# Altium schematic sheet SMA_RF_CLK.SchDoc
size 330 x 1066 mm
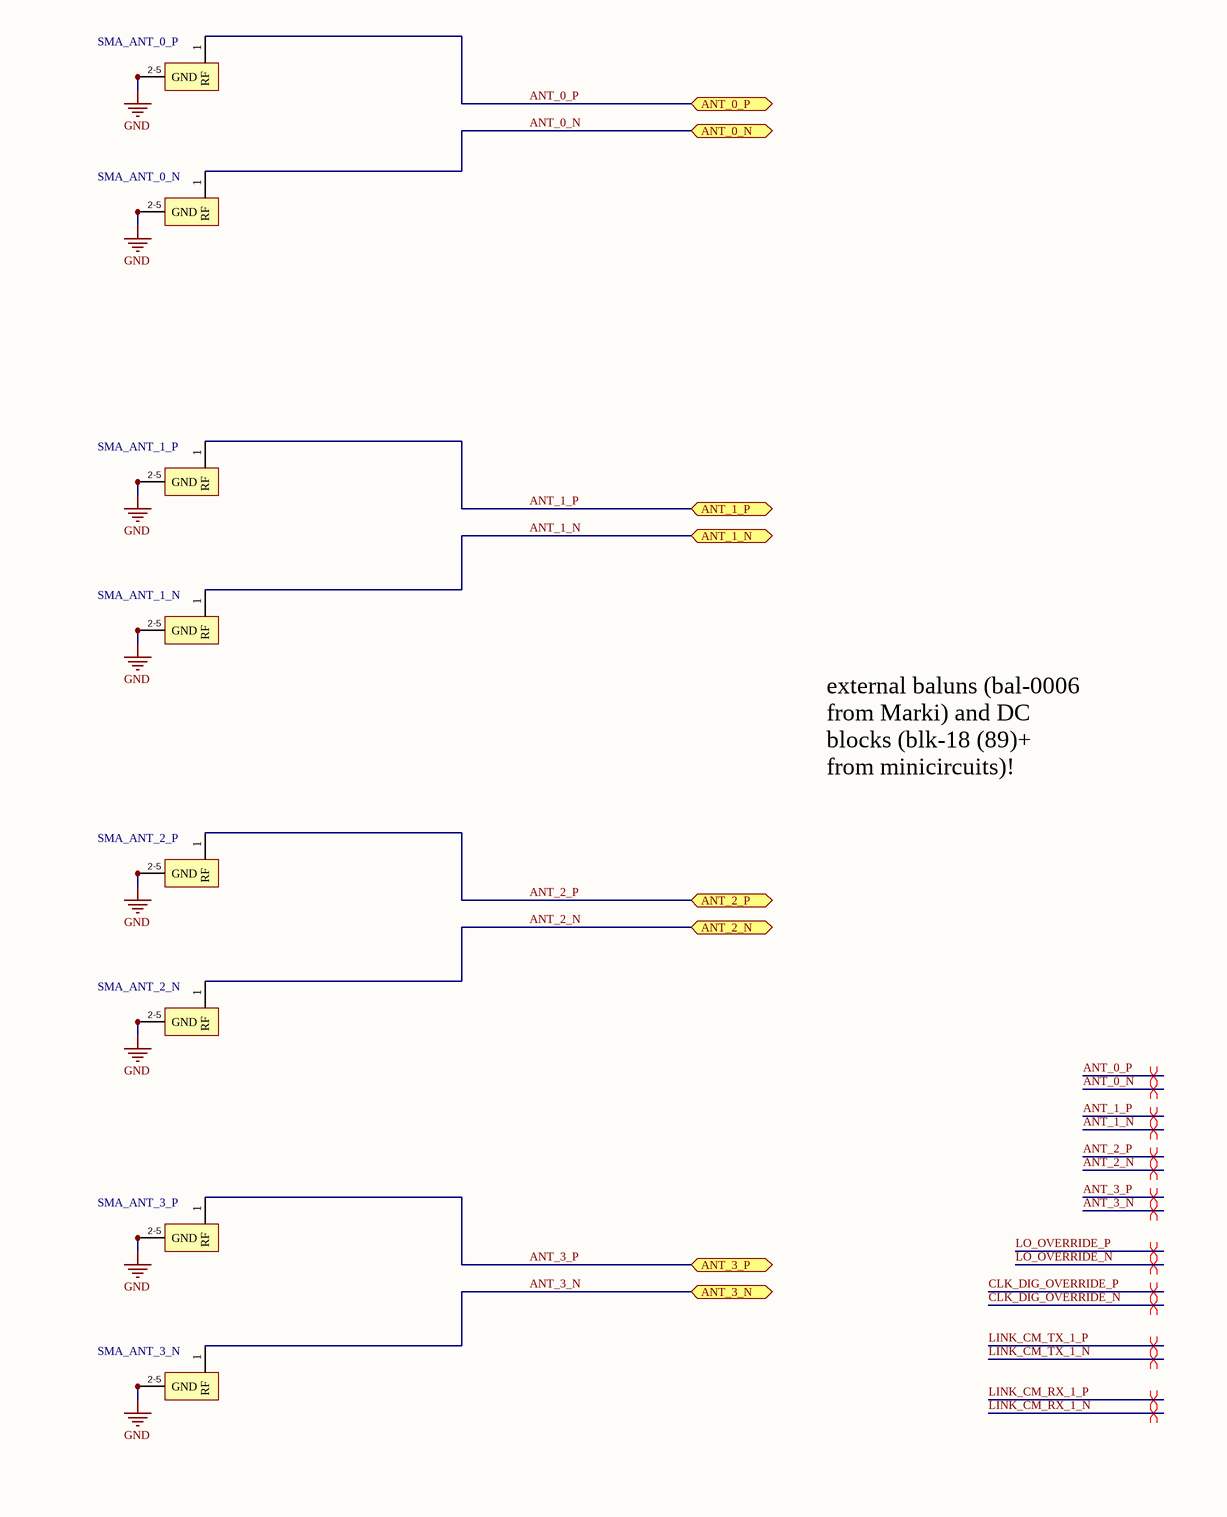
[diagram p0: SMA_RF_CLK.SchDoc, top]
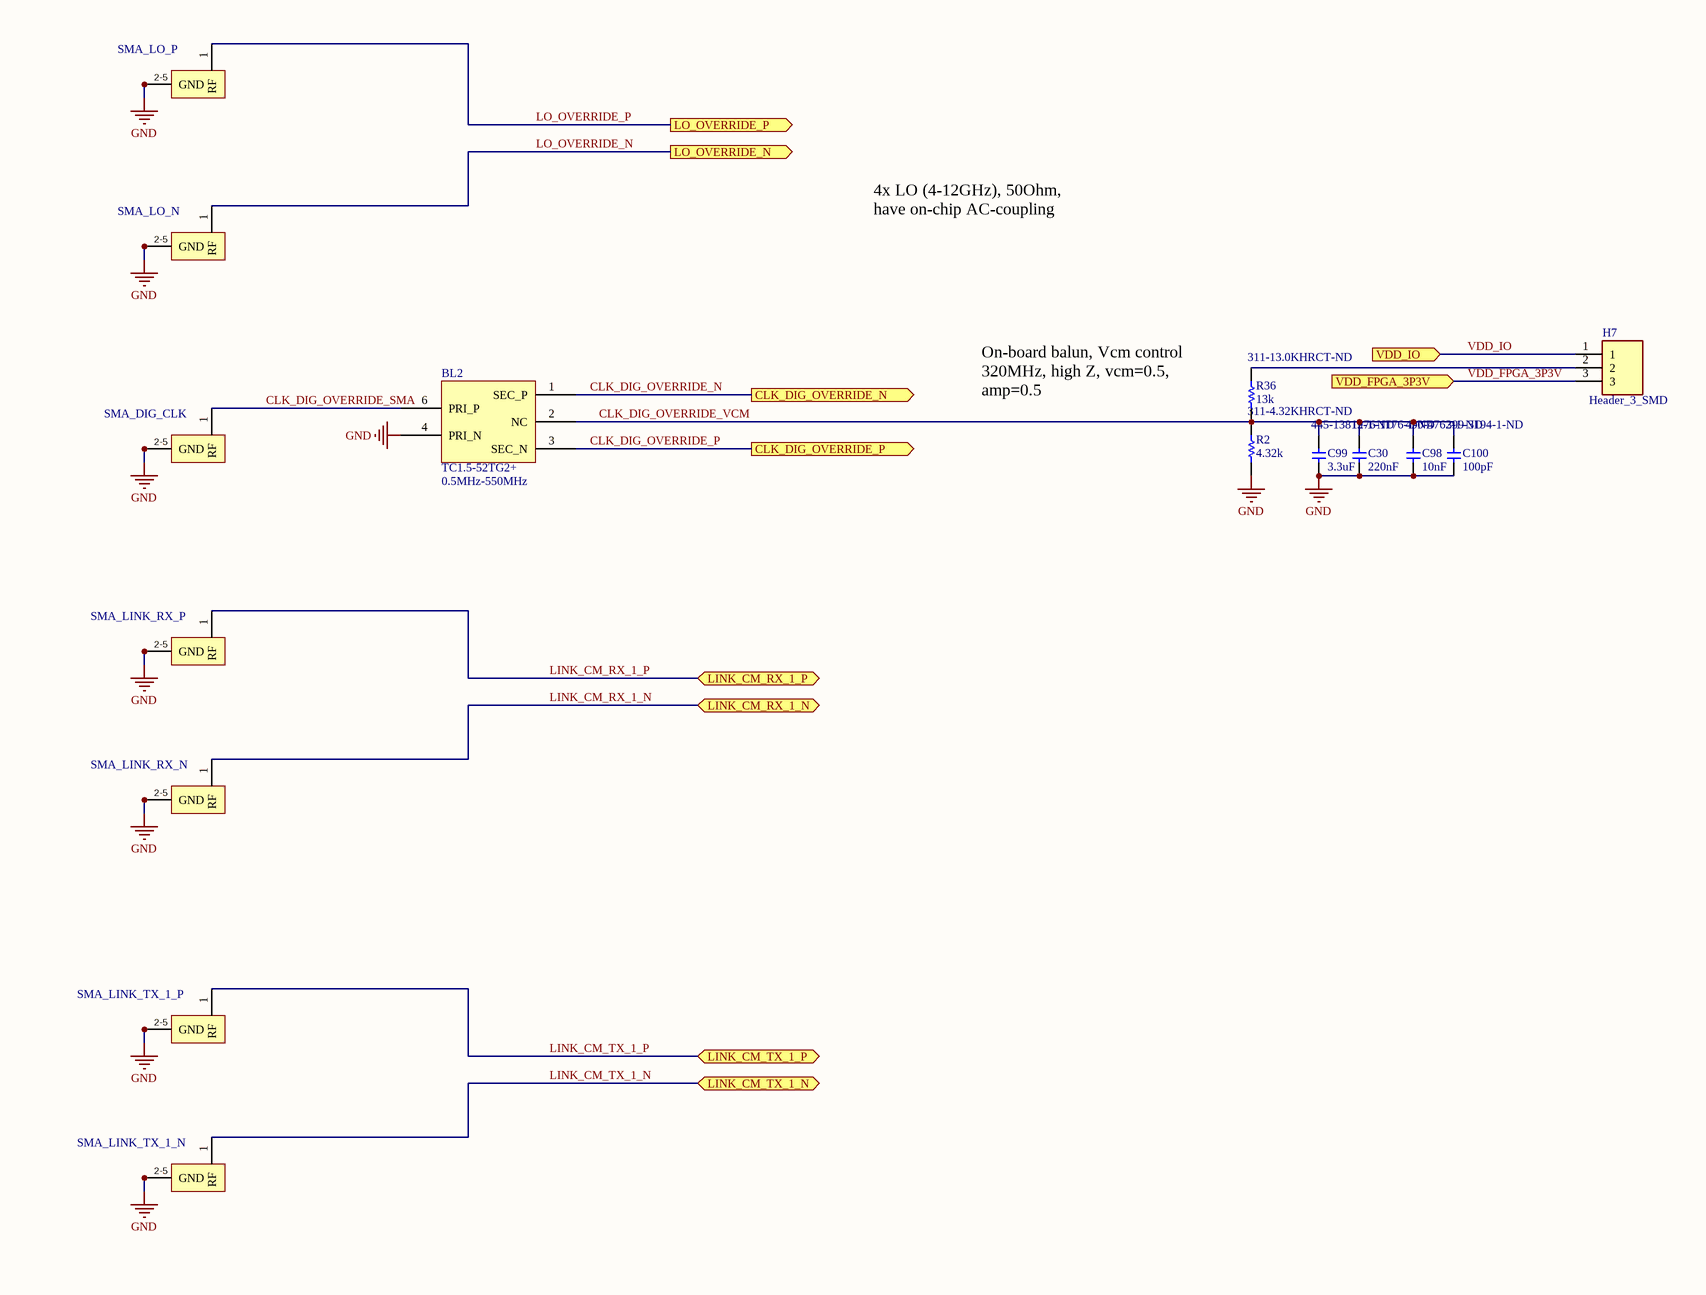
[diagram p1: SMA_RF_CLK.SchDoc, centre]
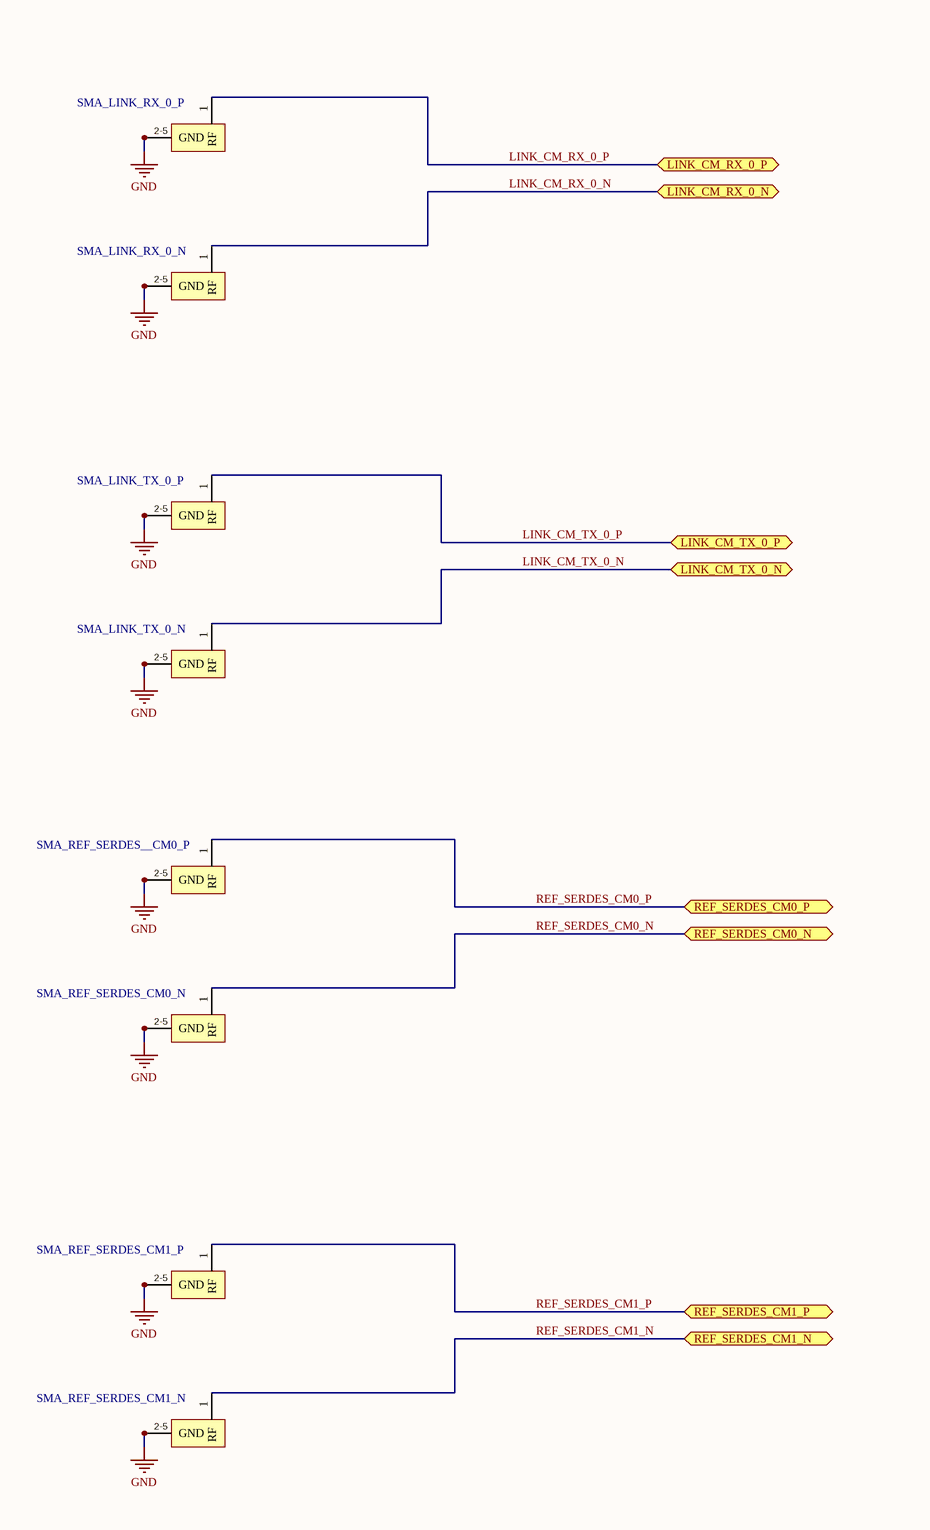
[diagram p2: SMA_RF_CLK.SchDoc, bottom]

## Parts
BL2  TC1.5-52TG2+  Frequency Range: 0.5MHz-550MHz  [AT224-3]
C30  220nF  Supplier Part Number 1: 1276-1176-1-ND  [CAP_0402]
C98  10nF  Supplier Part Number 1: 490-4762-1-ND  [CAPC1005X06L_HD]
C99  3.3uF  Supplier Part Number 1: 445-13819-1-ND  [CAP_0402]
C100  100pF  Supplier Part Number 1: 399-3194-1-ND  [CAPC1005X06L_HD]
H7  Header_3_SMD  [HDR1X3_SMD]
R2  4.32k  Supplier Part Number 1: 311-4.32KHRCT-ND  [RES_0603]
R36  13k  Supplier Part Number 1: 311-13.0KHRCT-ND  [RES_0603]
SMA_ANT_0_N  CONSMA001-SMD-G  [CON-SMA-SMD]  (value not drawn)
SMA_ANT_0_P  CONSMA001-SMD-G  [CON-SMA-SMD]  (value not drawn)
SMA_ANT_1_N  CONSMA001-SMD-G  [CON-SMA-SMD]  (value not drawn)
SMA_ANT_1_P  CONSMA001-SMD-G  [CON-SMA-SMD]  (value not drawn)
SMA_ANT_2_N  CONSMA001-SMD-G  [CON-SMA-SMD]  (value not drawn)
SMA_ANT_2_P  CONSMA001-SMD-G  [CON-SMA-SMD]  (value not drawn)
SMA_ANT_3_N  CONSMA001-SMD-G  [CON-SMA-SMD]  (value not drawn)
SMA_ANT_3_P  CONSMA001-SMD-G  [CON-SMA-SMD]  (value not drawn)
SMA_DIG_CLK  CONSMA001-SMD-G  [CON-SMA-SMD]  (value not drawn)
SMA_LINK_RX_0_N  CONSMA001-SMD-G  [CON-SMA-SMD]  (value not drawn)
SMA_LINK_RX_0_P  CONSMA001-SMD-G  [CON-SMA-SMD]  (value not drawn)
SMA_LINK_RX_N  CONSMA001-SMD-G  [CON-SMA-SMD]  (value not drawn)
SMA_LINK_RX_P  CONSMA001-SMD-G  [CON-SMA-SMD]  (value not drawn)
SMA_LINK_TX_0_N  CONSMA001-SMD-G  [CON-SMA-SMD]  (value not drawn)
SMA_LINK_TX_0_P  CONSMA001-SMD-G  [CON-SMA-SMD]  (value not drawn)
SMA_LINK_TX_1_N  CONSMA001-SMD-G  [CON-SMA-SMD]  (value not drawn)
SMA_LINK_TX_1_P  CONSMA001-SMD-G  [CON-SMA-SMD]  (value not drawn)
SMA_LO_N  CONSMA001-SMD-G  [CON-SMA-SMD]  (value not drawn)
SMA_LO_P  CONSMA001-SMD-G  [CON-SMA-SMD]  (value not drawn)
SMA_REF_SERDES__CM0_P  CONSMA001-SMD-G  [CON-SMA-SMD]  (value not drawn)
SMA_REF_SERDES_CM0_N  CONSMA001-SMD-G  [CON-SMA-SMD]  (value not drawn)
SMA_REF_SERDES_CM1_N  CONSMA001-SMD-G  [CON-SMA-SMD]  (value not drawn)
SMA_REF_SERDES_CM1_P  CONSMA001-SMD-G  [CON-SMA-SMD]  (value not drawn)

## Ports
ANT_0_N (bidir), ANT_0_P (bidir), ANT_1_N (bidir), ANT_1_P (bidir), ANT_2_N (bidir), ANT_2_P (bidir), ANT_3_N (bidir), ANT_3_P (bidir), CLK_DIG_OVERRIDE_N (out), CLK_DIG_OVERRIDE_P (out), LINK_CM_RX_0_N (bidir), LINK_CM_RX_0_P (bidir), LINK_CM_RX_1_N (bidir), LINK_CM_RX_1_P (bidir), LINK_CM_TX_0_N (bidir), LINK_CM_TX_0_P (bidir), LINK_CM_TX_1_N (bidir), LINK_CM_TX_1_P (bidir), LO_OVERRIDE_N (out), LO_OVERRIDE_P (out), REF_SERDES_CM0_N (bidir), REF_SERDES_CM0_P (bidir), REF_SERDES_CM1_N (bidir), REF_SERDES_CM1_P (bidir), VDD_FPGA_3P3V (in), VDD_IO (in)

## Nets
GND: BL2.4(PRI_N) C30.2 C98.2 C99.2 C100.2 R2.2(BOT) SMA_ANT_0_N.2(GND) SMA_ANT_0_N.3(GND) SMA_ANT_0_N.4(GND) SMA_ANT_0_N.5(GND) SMA_ANT_0_P.2(GND) SMA_ANT_0_P.3(GND) SMA_ANT_0_P.4(GND) SMA_ANT_0_P.5(GND) SMA_ANT_1_N.2(GND) SMA_ANT_1_N.3(GND) SMA_ANT_1_N.4(GND) SMA_ANT_1_N.5(GND) SMA_ANT_1_P.2(GND) SMA_ANT_1_P.3(GND) SMA_ANT_1_P.4(GND) SMA_ANT_1_P.5(GND) SMA_ANT_2_N.2(GND) SMA_ANT_2_N.3(GND) SMA_ANT_2_N.4(GND) SMA_ANT_2_N.5(GND) SMA_ANT_2_P.2(GND) SMA_ANT_2_P.3(GND) SMA_ANT_2_P.4(GND) SMA_ANT_2_P.5(GND) SMA_ANT_3_N.2(GND) SMA_ANT_3_N.3(GND) SMA_ANT_3_N.4(GND) SMA_ANT_3_N.5(GND) SMA_ANT_3_P.2(GND) SMA_ANT_3_P.3(GND) SMA_ANT_3_P.4(GND) SMA_ANT_3_P.5(GND) SMA_DIG_CLK.2(GND) SMA_DIG_CLK.3(GND) SMA_DIG_CLK.4(GND) SMA_DIG_CLK.5(GND) SMA_LINK_RX_0_N.2(GND) SMA_LINK_RX_0_N.3(GND) SMA_LINK_RX_0_N.4(GND) SMA_LINK_RX_0_N.5(GND) SMA_LINK_RX_0_P.2(GND) SMA_LINK_RX_0_P.3(GND) SMA_LINK_RX_0_P.4(GND) SMA_LINK_RX_0_P.5(GND) SMA_LINK_RX_N.2(GND) SMA_LINK_RX_N.3(GND) SMA_LINK_RX_N.4(GND) SMA_LINK_RX_N.5(GND) SMA_LINK_RX_P.2(GND) SMA_LINK_RX_P.3(GND) SMA_LINK_RX_P.4(GND) SMA_LINK_RX_P.5(GND) SMA_LINK_TX_0_N.2(GND) SMA_LINK_TX_0_N.3(GND) SMA_LINK_TX_0_N.4(GND) SMA_LINK_TX_0_N.5(GND) SMA_LINK_TX_0_P.2(GND) SMA_LINK_TX_0_P.3(GND) SMA_LINK_TX_0_P.4(GND) SMA_LINK_TX_0_P.5(GND) SMA_LINK_TX_1_N.2(GND) SMA_LINK_TX_1_N.3(GND) SMA_LINK_TX_1_N.4(GND) SMA_LINK_TX_1_N.5(GND) SMA_LINK_TX_1_P.2(GND) SMA_LINK_TX_1_P.3(GND) SMA_LINK_TX_1_P.4(GND) SMA_LINK_TX_1_P.5(GND) SMA_LO_N.2(GND) SMA_LO_N.3(GND) SMA_LO_N.4(GND) SMA_LO_N.5(GND) SMA_LO_P.2(GND) SMA_LO_P.3(GND) SMA_LO_P.4(GND) SMA_LO_P.5(GND) SMA_REF_SERDES__CM0_P.2(GND) SMA_REF_SERDES__CM0_P.3(GND) SMA_REF_SERDES__CM0_P.4(GND) SMA_REF_SERDES__CM0_P.5(GND) SMA_REF_SERDES_CM0_N.2(GND) SMA_REF_SERDES_CM0_N.3(GND) SMA_REF_SERDES_CM0_N.4(GND) SMA_REF_SERDES_CM0_N.5(GND) SMA_REF_SERDES_CM1_N.2(GND) SMA_REF_SERDES_CM1_N.3(GND) SMA_REF_SERDES_CM1_N.4(GND) SMA_REF_SERDES_CM1_N.5(GND) SMA_REF_SERDES_CM1_P.2(GND) SMA_REF_SERDES_CM1_P.3(GND) SMA_REF_SERDES_CM1_P.4(GND) SMA_REF_SERDES_CM1_P.5(GND)
ANT_0_N: SMA_ANT_0_N.1(RF) ; port ANT_0_N
ANT_0_P: SMA_ANT_0_P.1(RF) ; port ANT_0_P
ANT_1_N: SMA_ANT_1_N.1(RF) ; port ANT_1_N
ANT_1_P: SMA_ANT_1_P.1(RF) ; port ANT_1_P
ANT_2_N: SMA_ANT_2_N.1(RF) ; port ANT_2_N
ANT_2_P: SMA_ANT_2_P.1(RF) ; port ANT_2_P
ANT_3_N: SMA_ANT_3_N.1(RF) ; port ANT_3_N
ANT_3_P: SMA_ANT_3_P.1(RF) ; port ANT_3_P
CLK_DIG_OVERRIDE_N: BL2.1(SEC_P) ; port CLK_DIG_OVERRIDE_N
CLK_DIG_OVERRIDE_P: BL2.3(SEC_N) ; port CLK_DIG_OVERRIDE_P
CLK_DIG_OVERRIDE_SMA: BL2.6(PRI_P) SMA_DIG_CLK.1(RF)
CLK_DIG_OVERRIDE_VCM: BL2.2(NC) C30.1 C98.1 C99.1 C100.1 R2.1(TOP) R36.2(BOT)
LINK_CM_RX_0_N: SMA_LINK_RX_0_N.1(RF) ; port LINK_CM_RX_0_N
LINK_CM_RX_0_P: SMA_LINK_RX_0_P.1(RF) ; port LINK_CM_RX_0_P
LINK_CM_RX_1_N: SMA_LINK_RX_N.1(RF) ; port LINK_CM_RX_1_N
LINK_CM_RX_1_P: SMA_LINK_RX_P.1(RF) ; port LINK_CM_RX_1_P
LINK_CM_TX_0_N: SMA_LINK_TX_0_N.1(RF) ; port LINK_CM_TX_0_N
LINK_CM_TX_0_P: SMA_LINK_TX_0_P.1(RF) ; port LINK_CM_TX_0_P
LINK_CM_TX_1_N: SMA_LINK_TX_1_N.1(RF) ; port LINK_CM_TX_1_N
LINK_CM_TX_1_P: SMA_LINK_TX_1_P.1(RF) ; port LINK_CM_TX_1_P
LO_OVERRIDE_N: SMA_LO_N.1(RF) ; port LO_OVERRIDE_N
LO_OVERRIDE_P: SMA_LO_P.1(RF) ; port LO_OVERRIDE_P
REF_SERDES_CM0_N: SMA_REF_SERDES_CM0_N.1(RF) ; port REF_SERDES_CM0_N
REF_SERDES_CM0_P: SMA_REF_SERDES__CM0_P.1(RF) ; port REF_SERDES_CM0_P
REF_SERDES_CM1_N: SMA_REF_SERDES_CM1_N.1(RF) ; port REF_SERDES_CM1_N
REF_SERDES_CM1_P: SMA_REF_SERDES_CM1_P.1(RF) ; port REF_SERDES_CM1_P
VDD_FPGA_3P3V: H7.3 ; port VDD_FPGA_3P3V
VDD_IO: H7.1 ; port VDD_IO
NetH7_2: H7.2 R36.1(TOP)

## Layout directives
differential pair: ANT_0_N, ANT_0_P, ANT_1_N, ANT_1_P, ANT_2_N, ANT_2_P, ANT_3_N, ANT_3_P, CLK_DIG_OVERRIDE_N, CLK_DIG_OVERRIDE_P, LINK_CM_RX_1_N, LINK_CM_RX_1_P, LINK_CM_TX_1_N, LINK_CM_TX_1_P, LO_OVERRIDE_N, LO_OVERRIDE_P

## Notes on the sheet
- external baluns (bal-0006 from Marki) and DC blocks (blk-18 (89)+ from minicircuits)!
- 4x LO (4-12GHz), 50Ohm, have on-chip AC-coupling cap
- On-board balun, Vcm control
  320MHz, high Z, vcm=0.5, amp=0.5
- (in symbol SURFACE MOUNT SMA CONNECTOR) 2-5

## Library data of the parts
BL2 = TC1.5-52TG2+: Balun, 1:1.5 CORE & WIRE Transformer, 0.5 - 550 MHz, 50Ω; Manufacturer: Mini-Circuits; Manufacturer ID: TC1.5-52TG2+
C30 = cap 220nF: CAP CER 0.22uF 10% 16V X7R 0402; Manufacturer: Samsung Electro-Mechanics; Manufacturer ID: CL05B224KO5NNNC; Digikey ID: 1276-1176-1-ND; Value: 0.22uF; Package: 0402; Supplier 1: Digi-Key
C98 = cap 10nF: CAP CER 10nF 10% 50V X7R 0402; Manufacturer: Murata; Manufacturer ID: GCM155R71H103KA55D; Value: 10000pF; Digikey ID: 490-4762-1-ND; Package: 0402; Supplier 1: Digi-Key
C99 = cap 3p3uF: CAP CER 3.3uF 10% 10V X5R 0402; Manufacturer: TDK; Manufacturer ID: C1005X5R1A335K050BC; Digikey ID: 445-13819-1-ND; Value: 3.3uF; Package: 0402; Supplier 1: Digi-Key
C100 = cap 100pF 0402: CAP CER 100pF 5% 50V C0G/NP0 0402; Manufacturer: Kemet; Manufacturer ID: C0402C101J5GACTU; Digikey ID: 399-3194-1-ND; Value: 100pF; Package: 0402; Supplier 1: Digi-Key
H7 = Header_3_SMD: Connector Header Vertical, SMD, 3 position 0.100" (2.54mm); Manufacturer_Name: SAMTEC; Manufacturer_Part_Number: TSM-103-01-S-SV-P-TR; Supplier 1: Newark; Supplier Part Number 1: 80K8300; Datasheet Link: http://suddendocs.samtec.com/prints/tsm-1xx-xx-xxx-sv-xx-xxx-xx-mkt.pdf; Height: 11.17mm; Arrow Part Number: TSM-103-01-S-SV-P-TR; Arrow Price/Stock: https://www.arrow.com/en/products/tsm-103-01-s-sv-p-tr/samtec; Mouser Part Number: 200-TSM10301SSVPTR; Mouser Price/Stock: https://www.mouser.co.uk/ProductDetail/Samtec/TSM-103-01-S-SV-P-TR?qs=FESYatJ8odJI6Ns4akqicQ%3D%3D; Supplier 2: Digi-Key; Supplier Part Number 2: SAM13283CT-ND
R2 = res 4.32 kOhm_1: RES SMD 4.32kOHM 1% 1/10W 0603; Package: 0603; Supplier 1: Digi-Key; Supplier 2: Digi-Key; Supplier Part Number 2: 541-4.32KHCT-ND
R36 = res 13 kOhm_1: RES SMD 13k OHM 1% 1/10W 0603; Package: 0603; Supplier 1: Digi-Key; Supplier 2: Digi-Key; Supplier Part Number 2: 541-13.0KHCT-ND
SMA_ANT_0_N SMA_ANT_0_P SMA_ANT_1_N SMA_ANT_1_P SMA_ANT_2_N SMA_ANT_2_P SMA_ANT_3_N SMA_ANT_3_P SMA_DIG_CLK SMA_LINK_RX_0_N SMA_LINK_RX_0_P SMA_LINK_RX_N SMA_LINK_RX_P SMA_LINK_TX_0_N SMA_LINK_TX_0_P SMA_LINK_TX_1_N SMA_LINK_TX_1_P SMA_LO_N SMA_LO_P SMA_REF_SERDES__CM0_P SMA_REF_SERDES_CM0_N SMA_REF_SERDES_CM1_N SMA_REF_SERDES_CM1_P = SURFACE MOUNT SMA CONNECTOR: SMD SMA CONNECTOR; Manufacturer 1: Linx Technologies; Supplier 1: Digi-Key; Supplier Part Number 1: CONSMA001-SMD-ND; Manufacturer Part Number 1: CONSMA001-SMD-G; Manufacturer Part Number 2: CONSMA002-SMD; Supplier Part Number 2: CONSMA002-SMD-ND